# Altium schematic sheet hv_io_shutdown.SchDoc
size A4; Organization: Badgerloop; Address1: 133 Engineering Research; Address2: Building; Address3: Madison, WI 53715
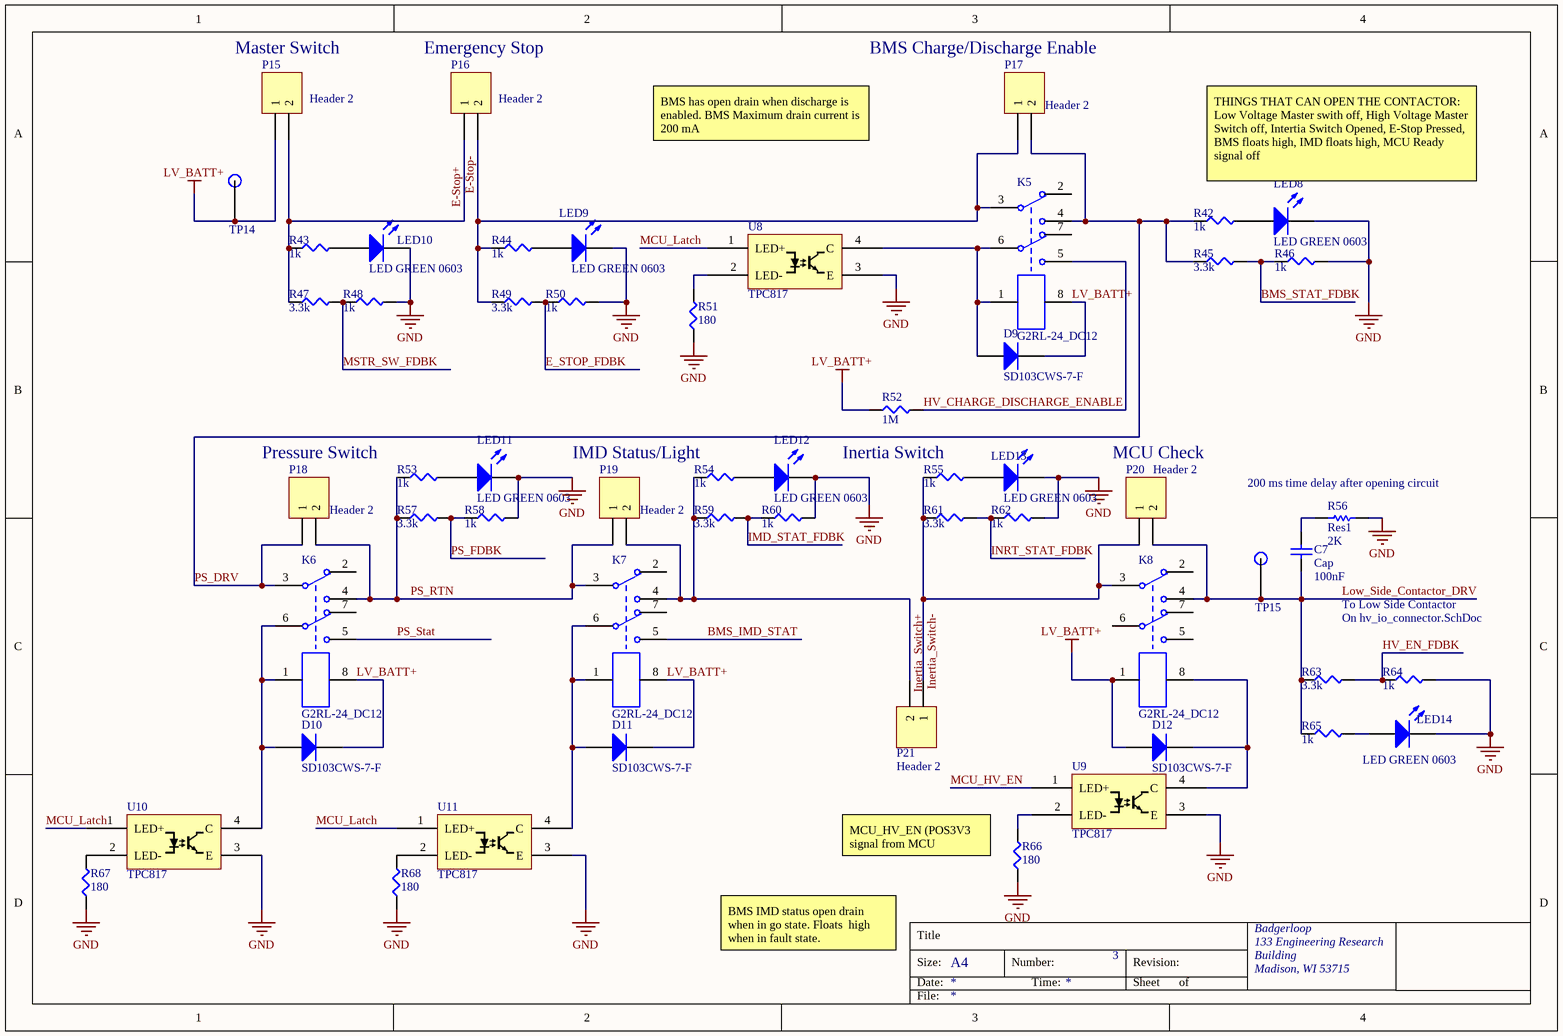
[diagram p0: hv_io_shutdown.SchDoc]

## Parts
C7  Cap  value 100nF  [SMD-1206C]
D9  SD103CWS-7-F  [SODFL250X110-2N]
D10  SD103CWS-7-F  [SODFL250X110-2N]
D11  SD103CWS-7-F  [SODFL250X110-2N]
D12  SD103CWS-7-F  [SODFL250X110-2N]
K5  G2RL-24_DC12  [G2RL]
K6  G2RL-24_DC12  [G2RL]
K7  G2RL-24_DC12  [G2RL]
K8  G2RL-24_DC12  [G2RL]
LED8  LED GREEN 0603  [LED 0603 GREEN]
LED9  LED GREEN 0603  [LED 0603 GREEN]
LED10  LED GREEN 0603  [LED 0603 GREEN]
LED11  LED GREEN 0603  [LED 0603 GREEN]
LED12  LED GREEN 0603  [LED 0603 GREEN]
LED13  LED GREEN 0603  [LED 0603 GREEN]
LED14  LED GREEN 0603  [LED 0603 GREEN]
P15  Header 2  [Pin Header 1x2 TH Pitch 2.54mm]
P16  Header 2  [Pin Header 1x2 TH Pitch 2.54mm]
P17  Header 2  [Pin Header 1x2 TH Pitch 2.54mm]
P18  Header 2  [Pin Header 1x2 TH Pitch 2.54mm]
P19  Header 2  [Pin Header 1x2 TH Pitch 2.54mm]
P20  Header 2  [Pin Header 1x2 TH Pitch 2.54mm]
P21  Header 2  [Pin Header 1x2 TH Pitch 2.54mm]
R42  1k  [SMD-0402-RES]
R43  1k  [SMD-0402-RES]
R44  1k  [SMD-0402-RES]
R45  3.3k  [SMD-0402-RES]
R46  1k  [SMD-0402-RES]
R47  3.3k  [SMD-0402-RES]
R48  1k  [SMD-0402-RES]
R49  3.3k  [SMD-0402-RES]
R50  1k  [SMD-0402-RES]
R51  180  [SMD-1206-RES]
R52  1M  [SMD-0805-RES]
R53  1k  [SMD-0402-RES]
R54  1k  [SMD-0402-RES]
R55  1k  [SMD-0402-RES]
R56  Res1  value 2K  [SMD-1206-RES]
R57  3.3k  [SMD-0402-RES]
R58  1k  [SMD-0402-RES]
R59  3.3k  [SMD-0402-RES]
R60  1k  [SMD-0402-RES]
R61  3.3k  [SMD-0402-RES]
R62  1k  [SMD-0402-RES]
R63  3.3k  [SMD-0402-RES]
R64  1k  [SMD-0402-RES]
R65  1k  [SMD-0402-RES]
R66  180  [SMD-1206-RES]
R67  180  [SMD-1206-RES]
R68  180  [SMD-1206-RES]
TP14  TP  [Test Point]  (value not drawn)
TP15  TP  [Test Point]  (value not drawn)
U8  TPC817  [SOT200P1005X328-5N]
U9  TPC817  [SOT200P1005X328-5N]
U10  TPC817  [SOT200P1005X328-5N]
U11  TPC817  [SOT200P1005X328-5N]

## Nets
GND: LED8.2(K) LED9.2(K) LED10.2(K) LED11.2(K) LED12.2(K) LED13.2(K) LED14.2(K) R46.2 R48.2 R50.2 R51.1 R56.2 R58.2 R60.2 R62.2 R64.2 R66.1 R67.1 R68.1 U8.3(E) U9.3(E) U10.3(E) U11.3(E)
LV_BATT+: D9.2(K) D10.2(K) D11.2(K) D12.1(A) K5.8 K6.8 K7.8 K8.1 P15.1 R52.1 TP14.1
BMS_IMD_STAT: K7.5
BMS_STAT_FDBK: R45.2 R46.1
E-Stop+: P15.2 P16.1 R43.1 R47.1
E-Stop-: K5.3 P16.2 P17.1 R44.1 R49.1
E_STOP_FDBK: R49.2 R50.1
HV_CHARGE_DISCHARGE_ENABLE: K5.5 R52.2
HV_EN_FDBK: R63.2 R64.1
IMD_STAT_FDBK: R59.2 R60.1
Inertia_Switch+: K7.4 P19.2 P21.2 R54.1 R59.1
Inertia_Switch-: K8.3 P20.1 P21.1 R55.1 R61.1
INRT_STAT_FDBK: R61.2 R62.1
Low_Side_Contactor_DRV: C7.1 K8.4 P20.2 R63.1 R65.1 TP15.1
MCU_HV_EN: U9.1(LED+)
MCU_Latch: U8.1(LED+) U10.1(LED+) U11.1(LED+)
MSTR_SW_FDBK: R47.2 R48.1
PS_DRV: K5.4 K6.3 P17.2 P18.1 R42.1 R45.1
PS_FDBK: R57.2 R58.1
PS_RTN: K6.4 K7.3 P18.2 P19.1 R53.1 R57.1
PS_Stat: K6.5
NetC7_2: C7.2 R56.1
NetD9_1: D9.1(A) K5.1 K5.6 U8.4(C)
NetD10_1: D10.1(A) K6.1 K6.6 U10.4(C)
NetD11_1: D11.1(A) K7.1 K7.6 U11.4(C)
NetD12_2: D12.2(K) K8.8 U9.4(C)
NetLED8_1: LED8.1(A) R42.2
NetLED9_1: LED9.1(A) R44.2
NetLED10_1: LED10.1(A) R43.2
NetLED11_1: LED11.1(A) R53.2
NetLED12_1: LED12.1(A) R54.2
NetLED13_1: LED13.1(A) R55.2
NetLED14_1: LED14.1(A) R65.2
NetR51_2: R51.2 U8.2(LED-)
NetR66_2: R66.2 U9.2(LED-)
NetR67_2: R67.2 U10.2(LED-)
NetR68_2: R68.2 U11.2(LED-)

Not connected (* = marked no-connect by the designer): K5 2 7; K6 2 7; K7 2 7; K8 2 5 6 7

## Notes on the sheet
- Master Switch
- Emergency Stop
- BMS Charge/Discharge Enable
- BMS has open drain when discharge is enabled. BMS Maximum drain current is 200 mA
- THINGS THAT CAN OPEN THE CONTACTOR: Low Voltage Master swith off, High Voltage Master Switch off, Intertia Switch Opened, E-Stop Pressed,  BMS floats high, IMD floats high, MCU Ready signal off
- (near R53) Pressure Switch
- (near R54) IMD Status/Light
- (near R55) Inertia Switch
- MCU Check
- (near R56) 200 ms time delay after opening circuit
- To Low Side Contactor
- On hv_io_connector.SchDoc
- (near R66) MCU_HV_EN (POS3V3 signal from MCU
- BMS IMD status open drain when in go state. Floats  high when in fault state.
- 3
- Title
- Size:
- Date:
- A4
- Number:
- Time:
- Revision:
- Sheet
- of
- File:

## Library data of the parts
C7 = Cap: Capacitor; Published: 8-Jun-2000; LatestRevisionDate: 17-Jul-2002; LatestRevisionNote: Re-released for DXP Platform.; PackageReference: RAD-0.3; Publisher: Altium Limited; PackageDescription: Radial Cap, Thru-Hole; 2 Leads; 0.3 in Pin Spacing
D9-D12 = Diode General Purpose_2: DIODE GEN PURP 20V 350MA SOD323; Manufacturer: Diodes Incorporated; Manufacturer P/N: SD103CWS-7-F; Digikey P/N: SD103CWS-FDIDKR-ND; Package / Case: SOD323; Do Not Populate: *; ComponentLink1Description: Digikey; ComponentLink1URL: https://www.digikey.com/product-detail/en/diodes-incorporated/SD103CWS-7-F/SD103CWS-FDIDKR-ND/1836772; ComponentLink2Description: Datasheet; ComponentLink2URL: https://www.diodes.com/assets/Datasheets/ds30101.pdf; ComponentLink3Description: Dimensions; ComponentLink3URL: https://www.diodes.com/assets/Package-Files/SOD323.pdf
K5-K8 = G2RL-24_DC12: RELAY GEN PURPOSE DPDT 8A 12V; Manufacturer: Omron Electronics; Manufacturer P/N: G2RL-24 DC12; Digikey Link: https://www.digikey.com/product-detail/en/omron-electronics-inc-emc-div/G2RL-24-DC12/Z147-ND/307667; Digikey P/N: Z147-ND
LED8-LED14 = LED GREEN 0603: Manufacturer: Lite-On Inc.; Manufacturer P/N: LTST-C190KGKT; Digikey P/N: 160-1435-1-ND; Package / Case: 0603; Color: GREEN
P15-P21 = Header 2: Header, 2-Pin; LatestRevisionDate: 17-Jul-2002; LatestRevisionNote: Re-released for DXP Platform.; Publisher: Altium Limited
R42-R44 R46 R48 R50 R53-R55 R58 R60 R62 R64 R65 = ERJ-2GEJ102X: RES SMD 1K OHM 5% 1/10W 0402; Manufacturer: Panasonic Electronic Components; Factory Stock: 0; Unit Price (USD): 0.00350; @ qty: 1500; Minimum Quantity: 1; Power (Watts): 0.1W, 1/10W; Temperature Coefficient: ±200ppm/°C; Part Number: ERJ-2GEJ102X; Datasheets: http://industrial.panasonic.com/www-cgi/jvcr13pz.cgi?E+PZ+3+AOA0001+ERJ2GEJ102X+7+WW; Image: //media.digikey.com/Photos/Panasonic%20Photos/ERJ-PA2-Series.jpg; Digi-Key Part Number: P1.0KJCT-ND; Quantity Available: 1939857; Packaging: Cut Tape (CT); Series: ERJ; Part Status: Active; Value: 1k; Tolerance: ±5%; Composition: Thick Film; Features: Automotive AEC-Q200; Operating Temperature: -55°C ~ 155°C; Package / Case: 0402 (1005 Metric); Supplier Device Package: 0402; Size / Dimension: 0.039" L x 0.020" W (1.00mm x 0.50mm); Height - Seated (Max): 0.016" (0.40mm); Number of Terminations: 2; Failure Rate: -; Digikey P/N: ERJ-2GEJ102X
R45 R47 R49 R57 R59 R61 R63 = ERJ-2GEJ332X: RES SMD 3.3K OHM 5% 1/10W 0402; Manufacturer: Panasonic Electronic Components; Factory Stock: 0; Unit Price (USD): 0.00350; @ qty: 1500; Minimum Quantity: 1; Power (Watts): 0.1W, 1/10W; Temperature Coefficient: ±200ppm/°C; Part Number: ERJ-2GEJ332X; Datasheets: http://industrial.panasonic.com/www-cgi/jvcr13pz.cgi?E+PZ+3+AOA0001+ERJ2GEJ332X+7+WW; Image: //media.digikey.com/Photos/Panasonic%20Photos/ERJ-PA2-Series.jpg; Digi-Key Part Number: P3.3KJCT-ND; Quantity Available: 514266; Packaging: Cut Tape (CT); Series: ERJ; Part Status: Active; Value: 3.3k; Tolerance: ±5%; Composition: Thick Film; Features: Automotive AEC-Q200; Operating Temperature: -55°C ~ 155°C; Package / Case: 0402 (1005 Metric); Supplier Device Package: 0402; Size / Dimension: 0.039" L x 0.020" W (1.00mm x 0.50mm); Height - Seated (Max): 0.016" (0.40mm); Number of Terminations: 2; Failure Rate: -; Digikey P/N: ERJ-2GEJ332X
R51 R66-R68 = ERJ-8ENF1800V: RES SMD 180 OHM 1% 1/4W 1206; Manufacturer: Panasonic Electronic Components; Factory Stock: 0; Unit Price (USD): 0.00933; @ qty: 1500; Minimum Quantity: 1; Power (Watts): 0.25W, 1/4W; Temperature Coefficient: ±100ppm/°C; Part Number: ERJ-8ENF1800V; Datasheets: http://industrial.panasonic.com/www-cgi/jvcr13pz.cgi?E+PZ+3+AOA0002+ERJ8ENF1800V+7+WW; Image: //media.digikey.com/Renders/Panasonic%20Renders/ERJ-1206%20Pkg.jpg; Digi-Key Part Number: P180FCT-ND; Quantity Available: 4031; Packaging: Cut Tape (CT); Series: ERJ; Part Status: Active; Value: 180; Tolerance: ±1%; Composition: Thick Film; Features: Automotive AEC-Q200; Operating Temperature: -55°C ~ 155°C; Package / Case: 1206 (3216 Metric); Supplier Device Package: 1206; Size / Dimension: 0.126" L x 0.063" W (3.20mm x 1.60mm); Height - Seated (Max): 0.028" (0.70mm); Number of Terminations: 2; Failure Rate: -
R52 = ERJ-P06J105V: RES SMD 1M OHM 5% 1/2W 0805; Manufacturer: Panasonic Electronic Components; Factory Stock: 0; Unit Price (USD): 0.01839; @ qty: 1500; Minimum Quantity: 1; Power (Watts): 0.5W, 1/2W; Temperature Coefficient: ±200ppm/°C; Part Number: ERJ-P06J105V; Datasheets: https://industrial.panasonic.com/cdbs/www-data/pdf/RDA0000/AOA0000C243.pdf; Image: //media.digikey.com/Renders/Panasonic%20Renders/ERJ-0805%20Pkg.jpg; Digi-Key Part Number: P1.0MADCT-ND; Quantity Available: 36684; Packaging: Cut Tape (CT); Series: ERJ; Part Status: Active; Value: 1M; Tolerance: ±5%; Composition: Thick Film; Features: Automotive AEC-Q200, Pulse Withstanding; Operating Temperature: -55°C ~ 155°C; Package / Case: 0805 (2012 Metric); Supplier Device Package: 0805; Size / Dimension: 0.079" L x 0.049" W (2.00mm x 1.25mm); Height - Seated (Max): 0.028" (0.70mm); Number of Terminations: 2; Failure Rate: -; Digikey P/N: ERJ-P06J105V
R56 = Res1: Resistor; Published: 8-Jun-2000; LatestRevisionDate: 17-Jul-2002; LatestRevisionNote: Re-released for DXP Platform.; PackageReference: AXIAL-0.3; Publisher: Altium Limited; PackageDescription: Axial Device, Thru-Hole; 2 Leads; 0.3 in Pin Spacing
U8-U11 = TPC817: OPTOISO 5KV TRANS 4SOP; Manufacturer: Taiwan Semi; Manufacturer P/N: TPC817S1B RAG; Digikey Link: https://www.digikey.com/product-detail/en/taiwan-semiconductor-corporation/TPC817S1B-RAG/TPC817S1BRAGCT-ND/7359679; Digikey P/N: TPC817S1BRAGCT-ND